# EasyEDA Pro project 采样板.eprj

# Schematic Schematic1
Board Name: Board1; Create Date: 2025-03-08; Page Name: P1; Project Name: Sampler; Schematic Name: Schematic1; Update Date: 2025-03-24; Company: 嘉立创EDA; Page Size: A4; Version: V1.0
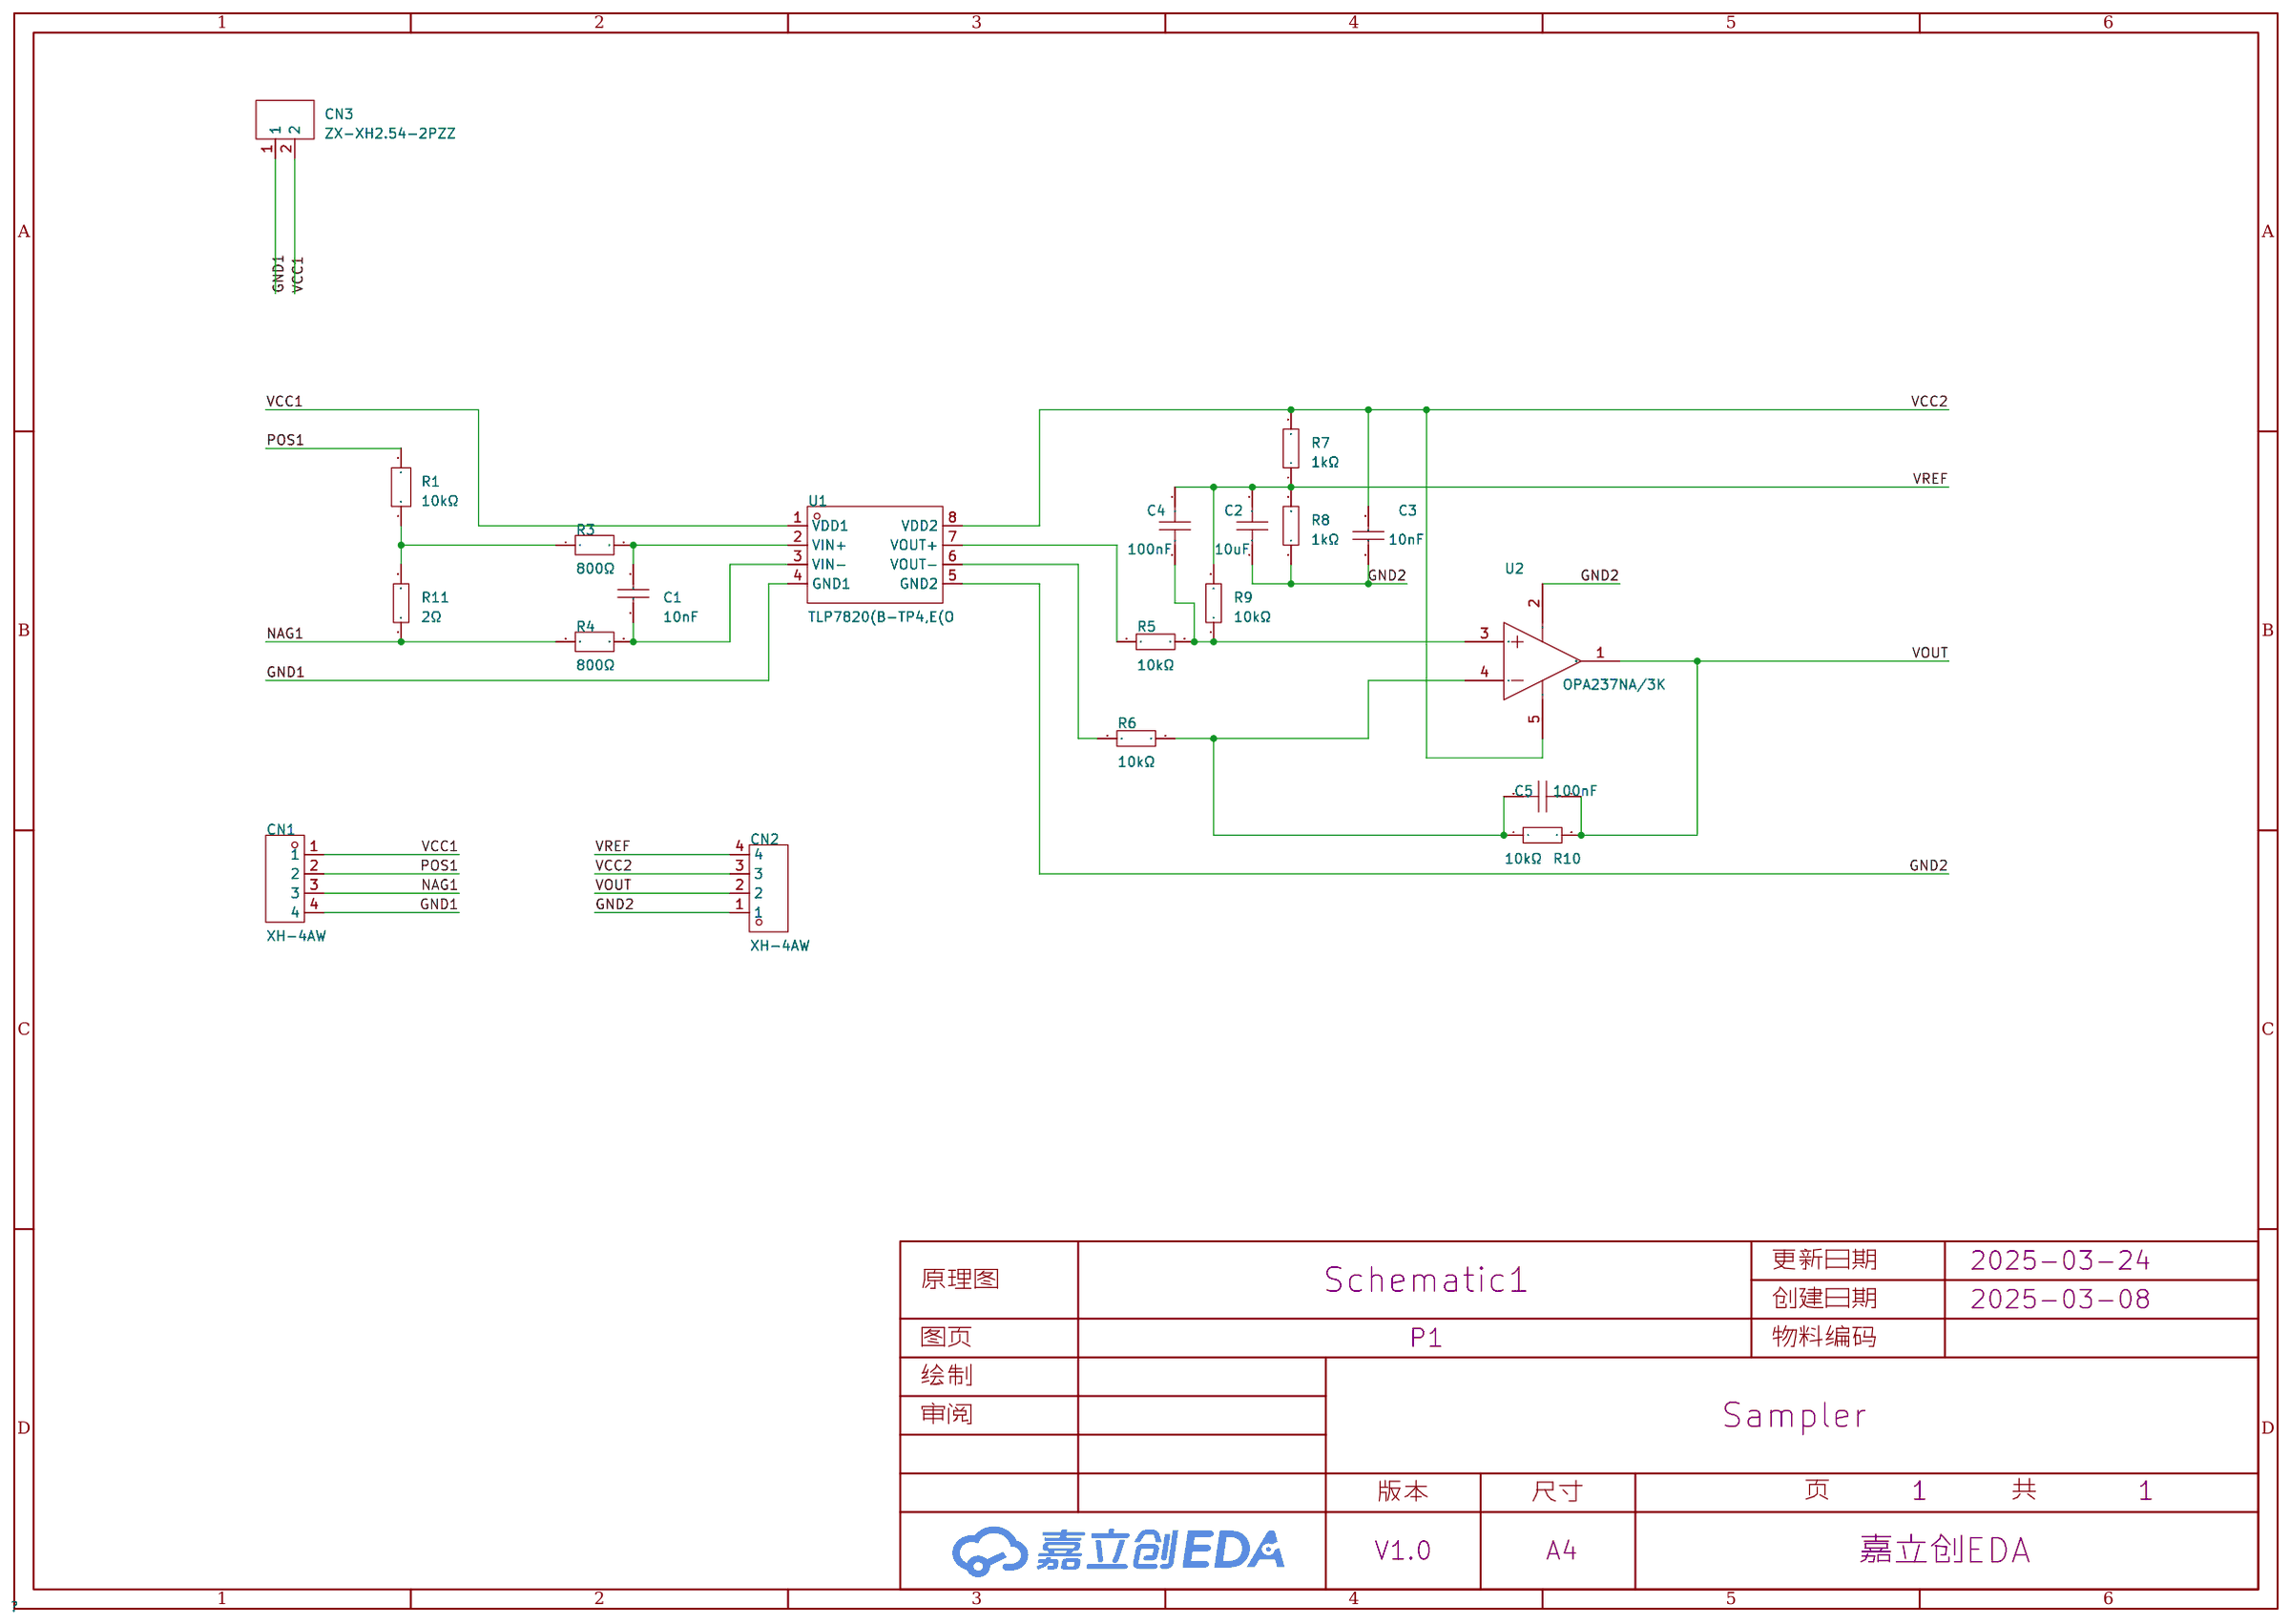
[diagram p0: schematic sheet]

## Parts
C1  10nF  [C0805]
C2  10uF  [C0603]
C3  10nF  [C0603]
C4  100nF  [C0603]
C5  100nF  [C0603]
CN1  XH-4AW  [CONN-TH_XH-4AW]
CN2  XH-4AW  [CONN-TH_XH-4AW]
CN3  ZX-XH2.54-2PZZ  [CONN-TH_2P-P2.50_HX25003-2A]
R1  10kΩ  [R0805]
R3  800Ω  [R0805]
R4  800Ω  [R0805]
R5  10kΩ  [R0603]
R6  10kΩ  [R0603]
R7  1kΩ  [R0603]
R8  1kΩ  [R0603]
R9  10kΩ  [R0603]
R10  10kΩ  [R0603]
R11  2Ω  [R0805]
U1  TLP7820(B-TP4,E(O  [SOIC-8_L5.9-W7.5-P1.27-LS11.5-BL]
U2  OPA237NA/3K  [SOT-23-5_L3.0-W1.7-P0.95-LS2.8-BR]

## Library data of the parts
C1 = CL21B103KBANNNC: LCSC Part Name: 10nF ±10% 50V; Supplier Part: C1710; Manufacturer: SAMSUNG(三星); Supplier Footprint: 0805; JLCPCB Part Class: Basic Part; Datasheet: https://atta.szlcsc.com/upload/public/pdf/source/20160218/1457707763339.pdf; Supplier: LCSC; Tolerance: ±10%; Voltage Rated: 50V; Temperature Coefficient: X7R
C2 = CGA0603X5R106K100JT: LCSC Part Name: 10uF ±10% 10V; Supplier Part: C6119842; Manufacturer: HRE(芯声); Supplier Footprint: 0603; JLCPCB Part Class: Extended Part; Supplier: LCSC; Tolerance: ±10%; Voltage Rating: 10V; Temperature Coefficient: X5R
C3 = CC0603KRX7R9BB103: LCSC Part Name: 10nF ±10% 50V; Supplier Part: C100042; Manufacturer: YAGEO(国巨); Supplier Footprint: 0603; JLCPCB Part Class: Extended Part; Datasheet: https://atta.szlcsc.com/upload/public/pdf/source/20181008/C309510_22F155564471FAF6A489F7D68F34234E.pdf; Supplier: LCSC; Tolerance: ±10%; Voltage Rated: 50V; Temperature Coefficient: X7R
C4 C5 = CGA0603X7R104K500JT: LCSC Part Name: 100nF ±10% 50V; Supplier Part: C6119867; Manufacturer: HRE(芯声); Supplier Footprint: 0603; JLCPCB Part Class: Extended Part; Datasheet: https://atta.szlcsc.com/upload/public/pdf/source/20250103/C44077DA9E7B3EFAE02F22B6D3D1CBC9.pdf; Supplier: LCSC; Tolerance: ±10%; Voltage Rating: 50V; Temperature Coefficient: X7R
CN1 CN2 = XH-4AW: LCSC Part Name: 1x4P 间距:2.54mm 弯插 系列:XH; Supplier Part: C2908613; Manufacturer: HCTL(华灿天禄); Supplier Footprint: 弯插,P=2.5mm; JLCPCB Part Class: Extended Part; Datasheet: https://atta.szlcsc.com/upload/public/pdf/source/20230711/B565BAF3B11666EF6B81B3605408F2BD.pdf; Supplier: LCSC; Pins Structure: 1x4P; Pitch: 2.54mm; Mounting Style: 弯插; Reference Series: XH; Number of Pins: 4P; Number of Rows: 1; Number of PINs Per Row: 4; Current Rating (Max): 3A; Contact Material: 黄铜; Contact Plating: 锡; Operating Temperature Range: -25℃~+85℃
CN3 = ZX-XH2.54-2PZZ: 插针结构:1x2P;间距:2.5mm;安装方式:直插;参考系列:XH;总PIN数:2P;排数:1;每排PIN数:2;行距:-;额定电流:3A;触头材质:黄铜;触头镀层:锡;工作温度范围:-25℃~+85℃;; LCSC Part Name: 1x2P 间距:2.5mm 直插 系列:XH; Supplier Part: C7429632; Manufacturer: Megastar(兆星); Supplier Footprint: 插件,P=2.5mm; JLCPCB Part Class: 扩展库; Datasheet: https://atta.szlcsc.com/upload/public/pdf/source/20230619/19BA6947230AA44A04D3EDD65E618FD0.pdf; Supplier: LCSC; Pins Structure: 1x2P; Pitch: 2.5mm; Mounting Type: 直插; Reference Series: XH; Number of Pins: 2P; Number of Rows: 1; Number of PINs Per Row: 2; Rated Current: 3A; Contact Material: 黄铜; Contact Plating: 锡; Operating Temperature: -25℃~+85℃; Rated Voltage (Max): 250V; Plastic Material: PA66; Flame Retardant Rating: UL94V-0; Color: 白色; Z-Height of the Board: 7mm; X-Length of Bottom Edge on Board (Spacing Line): 7.5mm; Y-Width of Bottom Edge on Board: 5.9mm
R1 = RT0805WRD0710KL: LCSC Part Name: 薄膜电阻 10kΩ ±0.05% 125mW; Supplier Part: C706400; Manufacturer: YAGEO(国巨); Supplier Footprint: 0805; JLCPCB Part Class: Extended Part; Datasheet: https://atta.szlcsc.com/upload/public/pdf/source/20200720/C706400_9E14D2B206DC937C0DDD07AA2EB01FD5.pdf; Supplier: LCSC; Type: 薄膜电阻; Tolerance: ±0.05%; Power(Watts): 125mW; Overload Voltage (Max): 150V; Temperature Coefficient: ±25ppm/℃; Operating Temperature Range: -55℃~+155℃
R3 R4 = 0805W8F8000T5E: LCSC Part Name: 800Ω ±1% 125mW 厚膜电阻; Supplier Part: C2767532; Manufacturer: UNI-ROYAL(厚声); Supplier Footprint: 0805; JLCPCB Part Class: Extended Part; Datasheet: https://atta.szlcsc.com/upload/public/pdf/source/20200306/C422600_1E6D84923E4A46A82E41ADD87F860B5C.pdf; Supplier: LCSC; Type: 厚膜电阻; Tolerance: ±1%; Power(Watts): 125mW; Overload Voltage (Max): 150V; Temperature Coefficient: ±100ppm/℃; Operating Temperature Range: -55℃~+155℃
R5 R6 R9 R10 = RT0603BRD0710KL: LCSC Part Name: 薄膜电阻 10kΩ ±0.1% 100mW; Supplier Part: C95204; Manufacturer: YAGEO(国巨); Supplier Footprint: 0603; JLCPCB Part Class: Extended Part; Datasheet: https://atta.szlcsc.com/upload/public/pdf/source/20170217/1487301593756.pdf; Supplier: LCSC; Type: 薄膜电阻; Tolerance: ±0.1%; Power(Watts): 100mW; Overload Voltage (Max): 75V; Temperature Coefficient: ±25ppm/℃; Operating Temperature Range: -55℃~+155℃
R7 R8 = RT0603BRD071KL: LCSC Part Name: 薄膜电阻 1kΩ ±0.1% 100mW; Supplier Part: C110776; Manufacturer: YAGEO(国巨); Supplier Footprint: 0603; JLCPCB Part Class: Extended Part; Datasheet: https://atta.szlcsc.com/upload/public/pdf/source/20170704/1499151282044.pdf; Supplier: LCSC; Type: 薄膜电阻; Tolerance: ±0.1%; Power(Watts): 100mW; Overload Voltage (Max): 75V; Temperature Coefficient: ±25ppm/℃; Operating Temperature Range: -55℃~+155℃
R11 = 0805W8F200KT5E: 电阻类型:厚膜电阻;阻值:2Ω;精度:±1%;功率:125mW;最大工作电压:150V;温度系数:±400ppm/℃;; LCSC Part Name: 2Ω ±1% 125mW 厚膜电阻; Supplier Part: C17606; Manufacturer: UNI-ROYAL(厚声); Supplier Footprint: 0805; JLCPCB Part Class: 扩展库; Datasheet: https://atta.szlcsc.com/upload/public/pdf/source/20200306/C422600_1E6D84923E4A46A82E41ADD87F860B5C.pdf; Supplier: LCSC; Type: 厚膜电阻; Tolerance: ±1%; Power(Watts): 125mW; Overload Voltage (Max): 150V; Temperature Coefficient: ±400ppm/℃; Operating Temperature Range: -55℃~+155℃
U1 = TLP7820(B-TP4,E(O: Supplier Part: C2936835; Manufacturer: TOSHIBA(东芝); Supplier Footprint: SOP-8L; JLCPCB Part Class: Extended Part; Supplier: LCSC
U2 = OPA237NA/3K: Supplier Part: C90349; Manufacturer: TI(德州仪器); Supplier Footprint: SOT-23-5; JLCPCB Part Class: Extended Part; Datasheet: https://www.ti.com/cn/lit/gpn/opa237; Supplier: LCSC; Number of Circuits: 单路; Gain Bandwidth Product(GBP): 1.5MHz; Current - Input Bias(Ib): 8.5nA; Slew Rate(SR): 0.5V/us; Output Current: 8mA; Supply Current: 200uA; Operating Temperature: -40℃~+85℃

## Nets
GND1: CN1.4 CN3.1 U1.4(GND1)
GND2: C2.1 C3.1 CN2.1 R8.1 U1.5(GND2) U2.2(V-)
VCC1: CN1.1 CN3.2 U1.1(VDD1)
VCC2: C3.2 CN2.3 R7.2 U1.8(VDD2) U2.5(V+)
NAG1: CN1.3 R4.1 R11.1
POS1: CN1.2 R1.2
VOUT: C5.1 CN2.2 R10.2 U2.1(OUT)
VREF: C2.2 C4.2 CN2.4 R7.1 R8.2 R9.2
$1N174: R1.1 R3.1 R11.2
$1N394: C1.2 R3.2 U1.2(VIN+)
$1N593: C1.1 R4.2 U1.3(VIN-)
$1N654: R5.1 U1.7(VOUT+)
$1N771: R6.1 U1.6(VOUT-)
$1N939: C4.1 R5.2 R9.1 U2.3(IN+)
$1N945: C5.2 R6.2 R10.1 U2.4(IN-)

# Board PCB1
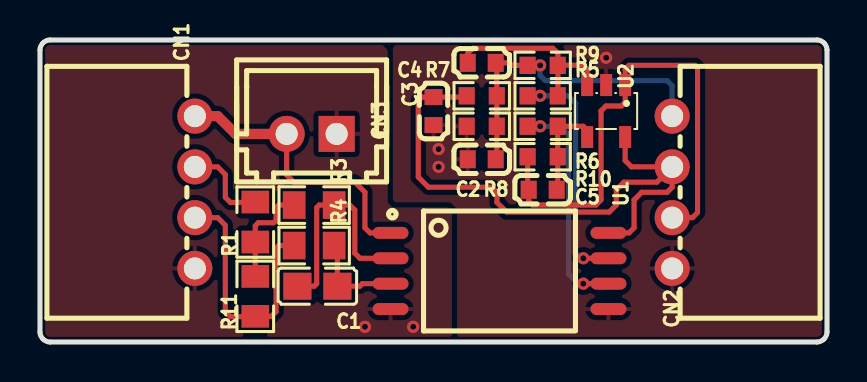
[diagram p1: board, top side]
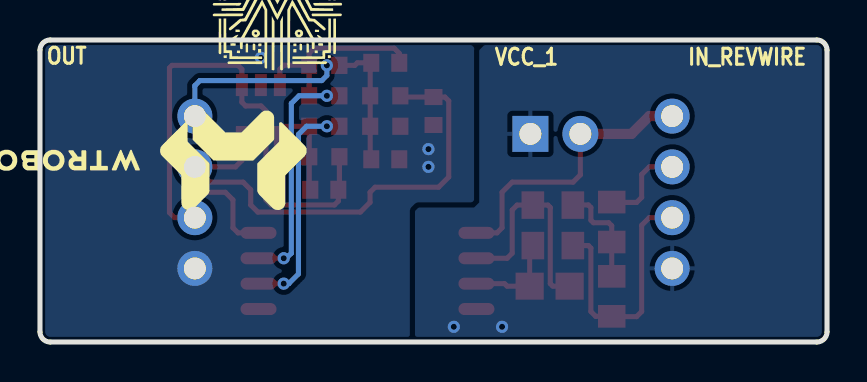
[diagram p2: board, bottom side, seen from below]

Outline 39.37 x 15.11 mm; copper layers: Top Layer, Bottom Layer. Coordinates in mm from the lower left corner of the outline.
Outline path: 0,14.61 0,0.51 arc(0.15,0.15) 0.51,0 38.86,0 arc(39.22,0.15) 39.37,0.51 39.37,14.61 arc(39.22,14.96) 38.86,15.11 0.51,15.11 arc(0.15,14.96) 0,14.61
Stack: Top Layer 0.035mm / Dielectric1 1.51mm FR4 er 4.5 / Bottom Layer 0.035mm

## Design rules (mm)
template: 自定义配置
spacing copperThickness1oz (default): track to track 0.102, other pairs 0.152 to 0.3
spacing copperThickness2oz: track to track 0.203, other pairs 0.152 to 0.3
track width copperThickness1oz (default): min 0.127, default 0.254, max 2.54
track width copperThickness2oz: min 0.203, default 0.254, max 2.54
differential pair differentialPair (default): width min 0.127, default 0.254, max 2.54; gap min 0.152, default 0.152
via viaSize (default): diameter min 0.5, default 0.61, max 10; hole min 0.3, default 0.305, max 6.3
net VCC1 uses copperRegion1

## Placement (name value [footprint] x y rotation side)
C1  10nF  [C0805]  13.88 2.79 180 top
C2  10uF  [C0603]  22.1 9.14 0 top
C3  10nF  [C0603]  19.69 11.56 90 top
C4  100nF  [C0603]  22.1 13.97 0 top
C5  100nF  [C0603]  25.15 7.62 0 top
CN1  XH-4AW  [CONN-TH_XH-4AW]  7.75 7.49 270 top
CN2  XH-4AW  [CONN-TH_XH-4AW]  31.62 7.49 90 top
CN3  ZX-XH2.54-2PZZ  [CONN-TH_2P-P2.50_HX25003-2A]  13.59 10.41 180 top
R1  10kΩ  [R0805]  10.77 6 90 top
R3  800Ω  [R0805]  13.72 6.85 0 top
R4  800Ω  [R0805]  13.72 4.83 0 top
R5  10kΩ  [R0603]  25.15 12.32 0 top
R6  10kΩ  [R0603]  25.15 10.8 0 top
R7  1kΩ  [R0603]  22.1 12.32 180 top
R8  1kΩ  [R0603]  22.1 10.8 0 top
R9  10kΩ  [R0603]  25.15 13.84 180 top
R10  10kΩ  [R0603]  25.15 9.27 180 top
R11  2Ω  [R0805]  10.77 2.29 90 top
U1  TLP7820(B-TP4,E(O  [SOIC-8_L5.9-W7.5-P1.27-LS11.5-BL]  22.99 3.56 270 top
U2  OPA237NA/3K  [SOT-23-5_L3.0-W1.7-P0.95-LS2.8-BR]  28.32 11.56 90 top

## Footprints (pads in the part's own frame, mm; a bottom-side part is the same pattern mirrored in y, then rotated)
C0603
  rect 0.8x0.9 smd: 1(-0.7,0) 2(0.7,0)
C0805
  rect 1.41x1.35 smd: 1(-1,0) 2(1,0)
CONN-TH_2P-P2.50_HX25003-2A
  rect 1.8x1.8 hole 1.1: 1(-1.25,0)
  round 1.8 hole 1.1: 2(1.25,0)
CONN-TH_XH-4AW
  round 1.75 hole 1.1: 1(-3.81,0) 2(-1.27,0) 3(1.27,0) 4(3.81,0)
R0603
  rect 0.806x0.864 smd: 1(-0.753,0) 2(0.753,0)
R0805
  rect 1.133x1.377 smd: 1(-1,0) 2(1,0)
SOIC-8_L5.9-W7.5-P1.27-LS11.5-BL
  oval 0.6x1.8 smd: 1(-1.905,-5.45) 2(-0.635,-5.45) 3(0.635,-5.45) 4(1.905,-5.45) 5(1.905,5.45) 6(0.635,5.45) 7(-0.635,5.45) 8(-1.905,5.45)
SOT-23-5_L3.0-W1.7-P0.95-LS2.8-BR
  rect 1.1x0.6 smd: 1(1.3,-0.95) 2(1.3,0) 3(1.3,0.95) 4(-1.3,0.95) 5(-1.3,-0.95)

## Nets
As in the schematic.

## Via types
v1: diameter 0.61, hole 0.305, Top Layer to Bottom Layer, 10 vias

## Routing (per net, layer and track width the routed paths; a pad name or vN(x,y) marks a point on that pad's centre or on a via; arc(x,y) is an arc through that point)
GND1:
  vias: v1(16.26,0.76) v1(18.67,0.76)
GND2:
  vias: v1(19.94,9.65) v1(19.94,8.76) v1(28.32,14.22)
VCC1: length 14.5
  Top Layer w0.254: U1.1 16.51,5.46 16.26,5.72 16.26,7.49 15.75,8 12.7,8 12.34,8.36 CN3.2
  Top Layer w0.508: CN1.1 8.89,11.3 9.78,10.41 CN3.2
VCC2: length 31.1
  Top Layer w0.254: R7.2 21.28,12.26 C3.2 19.12,12.26 18.92,12.06 18.92,8.26 19.43,7.75 22.61,7.75 22.86,7.49 22.86,6.98 23.34,6.5 28.47,6.5 28.83,6.86 28.83,7.62 29.21,8 30.86,8 CN2.3 ; CN2.3 29.59,8.76 29.27,9.08 U2.5 ; CN2.3 31.62,7.75 31.37,7.49 30.1,7.49 29.72,7.11 29.72,5.72 29.46,5.46 U1.8
NAG1: length 12.9
  Top Layer w0.254: CN1.3 8.89,6.22 9.27,5.84 9.27,1.52 9.53,1.27 10.75,1.27 R11.1 11.57,1.29 11.81,1.52 11.81,4.7 11.94,4.83 R4.1
POS1: length 4.4
  Top Layer w0.254: CN1.2 8.89,8.76 9.27,8.38 9.27,7.24 9.53,6.98 10.75,6.98 R1.2
VOUT: length 25.9
  Top Layer w0.254: R10.2 24.39,7.67 C5.1 24.45,7.05 24.64,6.86 27.81,6.86 28.07,7.11 28.07,11.57 28.31,11.81 29.08,11.81 29.27,12 U2.1 29.27,13.65 29.46,13.84 32.77,13.84 32.89,13.72 32.89,6.48 32.64,6.22 CN2.2
VREF: length 16
  Top Layer w0.254: C2.2 22.85,9.2 R8.2 R7.1 22.85,13.92 C4.2 23.5,13.97 23.62,13.84 R9.2 v1(25.02,13.84)
  Bottom Layer w0.254: CN2.4 31.62,12.83 31.37,13.08 25.27,13.08 25.02,13.34 v1(25.02,13.84)
$1N174: length 5.3
  Top Layer w0.254: R11.2 R1.1 10.77,5.82 10.92,5.97 11.68,5.97 11.81,6.1 11.81,6.73 11.94,6.86 12.71,6.86 R3.1
$1N394: length 10.9
  Top Layer w0.254: U1.2 16,4.19 15.75,4.45 15.75,6.6 15.5,6.85 R3.2 13.96,6.85 13.84,6.73 13.84,2.92 13.72,2.79 C1.2
$1N593: length 4.8
  Top Layer w0.254: U1.3 16.13,2.92 16,2.79 C1.1 14.88,4.67 R4.2
$1N654: length 11.8
  Top Layer w0.254: v1(27.18,4.19) U1.7 ; v1(25.02,12.32) R5.1
  Bottom Layer w0.254: v1(27.18,4.19) 27.05,4.19 26.8,4.45 26.8,11.94 26.42,12.32 v1(25.02,12.32)
$1N771: length 11.4
  Top Layer w0.254: v1(27.18,2.92) U1.6 ; v1(25.02,10.8) R6.1
  Bottom Layer w0.254: v1(27.18,2.92) 26.92,2.92 26.44,3.4 26.44,10.39 26.03,10.8 v1(25.02,10.8)
$1N939: length 9.7
  Top Layer w0.254: 25.91,13.85 27.17,13.85 27.37,13.65 U2.3 ; 25.91,13.85 25.91,14.45 25.65,14.7 21.65,14.7 21.4,14.45 C4.1 ; 25.91,13.85 25.91,12.33 R5.2 ; 25.91,13.85 R9.1
$1N945: length 5.1
  Top Layer w0.254: C5.2 25.9,7.67 R10.1 R6.2 27.18,10.8 27.37,10.6 U2.4

## Copper pours and planes (outline as drawn; the poured copper is in the pictures)
GND1 on Top Layer: 16.89,15.11 17.4,14.61 17.4,6.98 17.65,6.73 20.43,6.73 20.6,6.56 20.6,0 0,0 0,15.11
GND1 on Bottom Layer: 0,15.11 16.89,15.11 17.4,14.61 17.4,6.98 17.65,6.73 20.43,6.73 20.61,6.56 20.61,0 0,0
GND2 on Top Layer: 39.37,15.11 18.03,15.11 17.53,14.61 17.53,7.11 17.78,6.86 20.57,6.86 20.83,6.6 20.83,0 39.37,0
GND2 on Bottom Layer: 39.37,15.11 18.03,15.11 17.53,14.61 17.53,7.11 17.78,6.86 20.57,6.86 20.83,6.6 20.83,0 39.37,0

## Text on the board
Bottom Silkscreen Layer: IN_REVWIRE | VCC_1 | OUT
